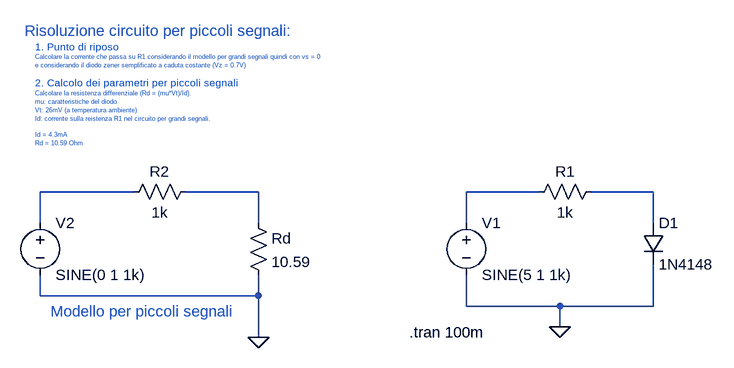
[diagram p0: schematic 07. modello per piccoli segnali.asc]
07. modello per piccoli segnali.asc, the LTspice schematic file:
Version 4
SHEET 1 880 680
WIRE -384 112 -528 112
WIRE -192 112 -304 112
WIRE 240 112 128 112
WIRE 416 112 320 112
WIRE -528 160 -528 112
WIRE -192 160 -192 112
WIRE 128 160 128 112
WIRE 416 160 416 112
WIRE -528 272 -528 240
WIRE -192 272 -192 240
WIRE -192 272 -528 272
WIRE 128 288 128 240
WIRE 272 288 128 288
WIRE 416 288 416 224
WIRE 416 288 272 288
WIRE 272 320 272 288
WIRE -192 336 -192 272
FLAG 272 320 0
FLAG -192 336 0
SYMBOL voltage 128 144 R0
WINDOW 123 0 0 Left 0
WINDOW 39 0 0 Left 0
SYMATTR InstName V1
SYMATTR Value SINE(5 1 1k)
SYMBOL res 336 96 R90
WINDOW 0 0 56 VBottom 2
WINDOW 3 32 56 VTop 2
SYMATTR InstName R1
SYMATTR Value 1k
SYMBOL diode 400 160 R0
SYMATTR InstName D1
SYMATTR Value 1N4148
SYMBOL voltage -528 144 R0
WINDOW 123 0 0 Left 0
WINDOW 39 0 0 Left 0
SYMATTR InstName V2
SYMATTR Value SINE(0 1 1k)
SYMBOL res -288 96 R90
WINDOW 0 0 56 VBottom 2
WINDOW 3 32 56 VTop 2
SYMATTR InstName R2
SYMATTR Value 1k
SYMBOL res -208 144 R0
SYMATTR InstName Rd
SYMATTR Value 10.59
TEXT 40 328 Left 2 !.tran 100m
TEXT -552 -136 Left 2 ;Risoluzione circuito per piccoli segnali:
TEXT -536 -112 Left 1 ;1. Punto di riposo
TEXT -536 -96 Left 0 ;Calcolare la corrente che passa su R1 considerando il modello per grandi segnali quindi con vs = 0\ne considerando il diodo zener semplificato a caduta costante (Vz = 0.7V)
TEXT -536 -56 Left 1 ;2. Calcolo dei parametri per piccoli segnali
TEXT -536 -40 Left 0 ;Calcolare la resistenza differenziale (Rd = (mu*Vt)/Id).\nmu: caratteristiche del diodo\nVt: 26mV (a temperatura ambiente)\nId: corrente sulla reistenza R1 nel circuito per grandi segnali.
TEXT -536 24 Left 0 ;Id = 4.3mA\nRd = 10.59 Ohm
TEXT -512 296 Left 2 ;Modello per piccoli segnali

The netlist it stands for:
* 07. modello per piccoli segnali.asc
V1 N003 0 SINE(5 1 1k)
R1 N004 N003 1k
D1 N004 0 1N4148
V2 N001 0 SINE(0 1 1k)
R2 N002 N001 1k
Rd N002 0 10.59
.model D D
.lib standard.dio
.tran 100m
* Risoluzione circuito per piccoli segnali:
* 1. Punto di riposo
* Calcolare la corrente che passa su R1 considerando il modello per grandi segnali quindi con vs = 0
* e considerando il diodo zener semplificato a caduta costante (Vz = 0.7V)
* 2. Calcolo dei parametri per piccoli segnali
* Calcolare la resistenza differenziale (Rd = (mu*Vt)/Id).
* mu: caratteristiche del diodo
* Vt: 26mV (a temperatura ambiente)
* Id: corrente sulla reistenza R1 nel circuito per grandi segnali.
* Id = 4.3mA
* Rd = 10.59 Ohm
* Modello per piccoli segnali
.backanno
.end